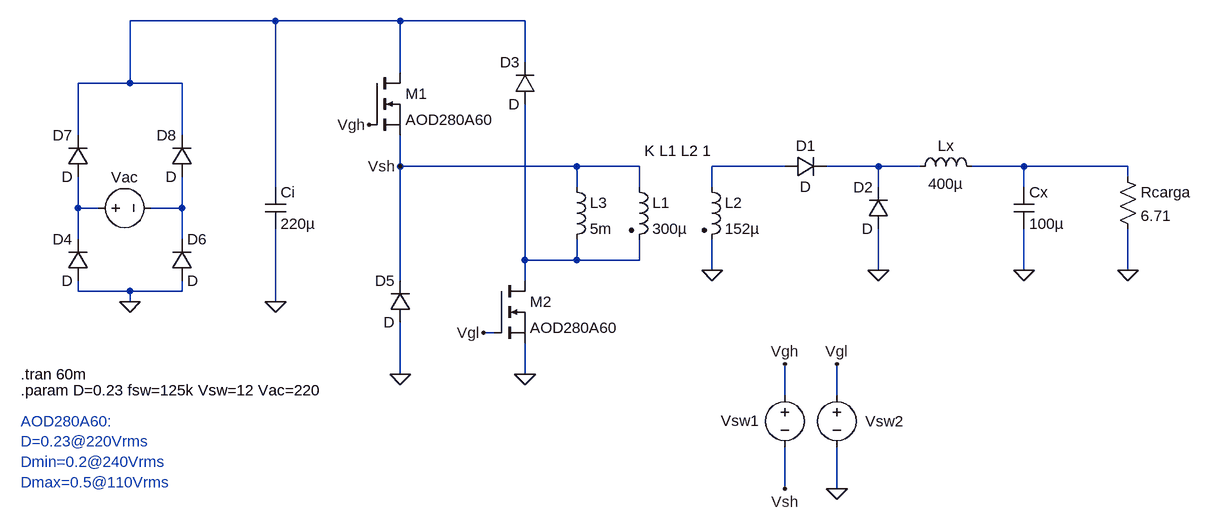
[diagram p0: schematic Forward.asc]
Forward.asc, the LTspice schematic file:
Version 4
SHEET 1 2088 1364
WIRE -176 -144 -400 -144
WIRE 16 -144 -176 -144
WIRE 208 -144 16 -144
WIRE 208 -80 208 -144
WIRE 16 -64 16 -144
WIRE -400 -48 -400 -144
WIRE -400 -48 -480 -48
WIRE -320 -48 -400 -48
WIRE -480 32 -480 -48
WIRE -320 32 -320 -48
WIRE 16 80 16 32
WIRE 288 80 16 80
WIRE 384 80 288 80
WIRE 608 80 496 80
WIRE 752 80 672 80
WIRE 816 80 752 80
WIRE 976 80 896 80
WIRE 1136 80 976 80
WIRE 1136 96 1136 80
WIRE -176 112 -176 -144
WIRE 288 112 288 80
WIRE 384 112 384 80
WIRE 496 112 496 80
WIRE 752 112 752 80
WIRE 976 112 976 80
WIRE -480 144 -480 96
WIRE -448 144 -480 144
WIRE -320 144 -320 96
WIRE -320 144 -368 144
WIRE -480 192 -480 144
WIRE -320 192 -320 144
WIRE 208 224 208 -16
WIRE 288 224 288 192
WIRE 288 224 208 224
WIRE 384 224 384 192
WIRE 384 224 288 224
WIRE 496 240 496 192
WIRE 752 240 752 176
WIRE 976 240 976 176
WIRE 1136 240 1136 176
WIRE 16 256 16 80
WIRE 208 256 208 224
WIRE -480 272 -480 256
WIRE -400 272 -480 272
WIRE -320 272 -320 256
WIRE -320 272 -400 272
WIRE -400 288 -400 272
WIRE -176 288 -176 176
WIRE 160 336 144 336
WIRE 16 400 16 320
WIRE 208 400 208 352
WIRE 608 432 608 384
WIRE 688 432 688 384
WIRE 608 576 608 512
WIRE 688 576 688 512
FLAG 496 240 0
FLAG 752 240 0
FLAG 976 240 0
FLAG 1136 240 0
FLAG 208 400 0
FLAG 16 400 0
FLAG -400 288 0
FLAG -176 288 0
FLAG -32 16 Vgh
FLAG 16 80 Vsh
FLAG 144 336 Vgl
FLAG 688 384 Vgl
FLAG 688 576 0
FLAG 608 384 Vgh
FLAG 608 576 Vsh
SYMBOL ind2 368 96 R0
SYMATTR InstName L1
SYMATTR Value 300µ
SYMATTR Type ind
SYMBOL ind2 480 96 R0
SYMATTR InstName L2
SYMATTR Value 152µ
SYMATTR Type ind
SYMBOL ind 800 96 R270
WINDOW 0 32 56 VTop 2
WINDOW 3 5 56 VBottom 2
SYMATTR InstName Lx
SYMATTR Value 400µ
SYMATTR SpiceLine Rser=20m
SYMBOL cap 960 112 R0
SYMATTR InstName Cx
SYMATTR Value 100µ
SYMATTR SpiceLine Rser=10m
SYMBOL res 1120 80 R0
SYMATTR InstName Rcarga
SYMATTR Value 6.71
SYMBOL voltage 688 416 R0
WINDOW 123 0 0 Left 0
WINDOW 39 0 0 Left 0
WINDOW 3 24 96 Invisible 2
WINDOW 0 44 56 Left 2
SYMATTR Value PULSE(0 {Vsw} 0 {1e-3/fsw} {1e-3/fsw} {D/fsw} {1/fsw})
SYMATTR InstName Vsw2
SYMBOL nmos 160 256 R0
SYMATTR InstName M2
SYMATTR Value AOD280A60
SYMBOL voltage 608 416 M0
WINDOW 123 0 0 Left 0
WINDOW 39 0 0 Left 0
WINDOW 3 24 96 Invisible 2
WINDOW 0 40 55 Left 2
SYMATTR Value PULSE(0 {Vsw} 0 {1e-3/fsw} {1e-3/fsw} {D/fsw} {1/fsw})
SYMATTR InstName Vsw1
SYMBOL diode 32 320 R180
WINDOW 0 24 64 Left 2
WINDOW 3 24 0 Left 2
SYMATTR InstName D5
SYMBOL diode 224 -16 R180
WINDOW 0 24 64 Left 2
WINDOW 3 24 0 Left 2
SYMATTR InstName D3
SYMBOL diode 608 96 R270
WINDOW 0 32 32 VTop 2
WINDOW 3 0 32 VBottom 2
SYMATTR InstName D1
SYMBOL diode 768 176 R180
WINDOW 0 24 64 Left 2
WINDOW 3 24 0 Left 2
SYMATTR InstName D2
SYMBOL nmos -32 -64 R0
SYMATTR InstName M1
SYMATTR Value AOD280A60
SYMBOL ind 272 96 R0
SYMATTR InstName L3
SYMATTR Value 5m
SYMBOL voltage -464 144 R270
WINDOW 0 32 56 VTop 2
WINDOW 3 -32 56 Invisible 2
WINDOW 123 0 0 Left 0
WINDOW 39 0 0 Left 0
SYMATTR InstName Vac
SYMATTR Value SINE(0 {Vac*sqrt(2)} 50)
SYMBOL cap -192 112 R0
SYMATTR InstName Ci
SYMATTR Value 220µ
SYMBOL diode -464 256 R180
WINDOW 0 24 64 Left 2
WINDOW 3 24 0 Left 2
SYMATTR InstName D4
SYMBOL diode -336 256 M180
WINDOW 0 24 64 Left 2
WINDOW 3 24 0 Left 2
SYMATTR InstName D6
SYMBOL diode -464 96 R180
WINDOW 0 24 64 Left 2
WINDOW 3 24 0 Left 2
SYMATTR InstName D7
SYMBOL diode -304 96 R180
WINDOW 0 24 64 Left 2
WINDOW 3 24 0 Left 2
SYMATTR InstName D8
TEXT 392 56 Left 2 !K L1 L2 1
TEXT -568 400 Left 2 !.tran 60m
TEXT -568 424 Left 2 !.param D=0.23 fsw=125k Vsw=12 Vac=220
TEXT -568 472 Left 2 ;AOD280A60:\nD=0.23@220Vrms\nDmin=0.2@240Vrms\nDmax=0.5@110Vrms

The netlist it stands for:
* Forward.asc
L1 Vsh N007 300µ
L2 N002 0 152µ
Lx N003 N004 400µ Rser=20m
Cx N004 0 100µ Rser=10m
Rcarga N004 0 6.71
Vsw2 Vgl 0 PULSE(0 {Vsw} 0 {1e-3/fsw} {1e-3/fsw} {D/fsw} {1/fsw})
M2 N007 Vgl 0 0 AOD280A60
Vsw1 Vgh Vsh PULSE(0 {Vsw} 0 {1e-3/fsw} {1e-3/fsw} {D/fsw} {1/fsw})
D5 0 Vsh D
D3 N007 N001 D
D1 N002 N003 D
D2 0 N003 D
M1 N001 Vgh Vsh Vsh AOD280A60
L3 Vsh N007 5m
Vac N005 N006 SINE(0 {Vac*sqrt(2)} 50)
Ci N001 0 220µ
D4 0 N005 D
D6 0 N006 D
D7 N005 N001 D
D8 N006 N001 D
.model D D
.lib standard.dio
.model NMOS NMOS
.model PMOS PMOS
.lib standard.mos
K L1 L2 1
.tran 60m
.param D=0.23 fsw=125k Vsw=12 Vac=220
* AOD280A60:
* D=0.23@220Vrms
* Dmin=0.2@240Vrms
* Dmax=0.5@110Vrms
.backanno
.end